# Altium schematic sheet IO.SchDoc: IO
size A4; ApprovedBy: Rachid AKKOUCHE; CheckedBy: Rachid AKKOUCHE; Author: Rachid AKKOUCHE; DrawnBy: Rachid AKKOUCHE; Engineer: Rachid AKKOUCHE; DocumentNumber: BRA20210209_2; SheetNumber: 2; SheetTotal: 4; Dessinepar: Rachid AKKOUCHE; ProjectName: Projet BRA
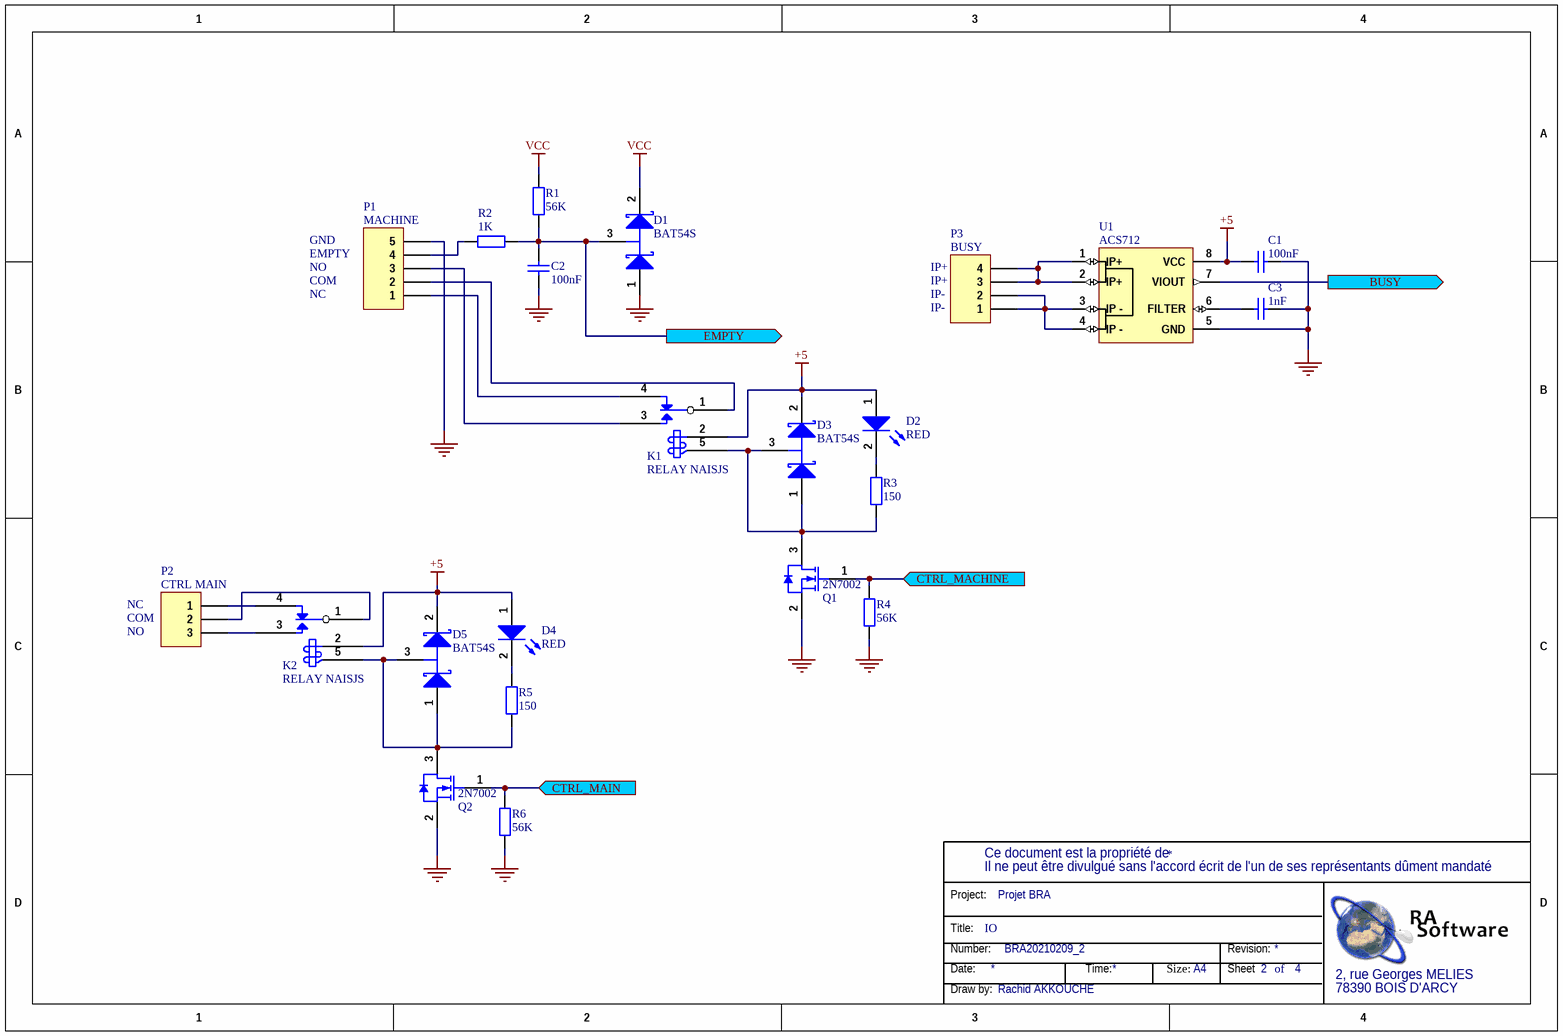
[diagram p0: IO.SchDoc]

## Parts
C1  100nF  [C 0805(2012)x0.65]
C2  100nF  [C 0805(2012)x0.65]
C3  1nF  [C 0805(2012)x0.65]
D1  BAT54S  [SOT23]
D2  RED  [0603-LEDR]
D3  BAT54S  [SOT23]
D4  RED  [0603-LEDR]
D5  BAT54S  [SOT23]
K1  RELAY NAISJS  [RELAIG5L]
K2  RELAY NAISJS  [RELAIG5L]
P1  MACHINE  [CO5P508-RIGHT]
P2  CTRL MAIN  [CO3P508 - 2]
P3  BUSY  [CO4P508]
Q1  2N7002  [SOT23]
Q2  2N7002  [SOT23]
R1  56K  [R 0805(2012)]
R2  1K  [R 0805(2012)]
R3  150  [R 0805(2012)]
R4  56K  [R 0805(2012)]
R5  150  [R 0805(2012)]
R6  56K  [R 0805(2012)]
U1  ACS712  [SOIC8]

## Ports
BUSY (out), CTRL_MACHINE (in), CTRL_MAIN (in), EMPTY (out)

## Nets
+5: C1.2 D2.1(A) D3.2(K) D4.1(A) D5.2(K) K1.2(COIL1) K2.2(COIL1) U1.8(VCC)
GND: C1.1 C2.1 C3.2 D1.1(A) P1.5 Q1.2(S) Q2.2(S) R4.1 R6.1 U1.5(GND)
VCC: D1.2(K) R1.2
BUSY: U1.7(VIOUT) ; port BUSY
CTRL_MACHINE: Q1.1(G) R4.2 ; port CTRL_MACHINE
CTRL_MAIN: Q2.1(G) R6.2 ; port CTRL_MAIN
EMPTY: C2.2 D1.3(C) R1.1 R2.1 ; port EMPTY
NetC3_1: C3.1 U1.6(FILTER)
NetD2_2: D2.2(K) R3.2
NetD3_1: D3.1(A) D3.3(C) K1.5(COIL2) Q1.3(D) R3.1
NetD4_2: D4.2(K) R5.2
NetD5_1: D5.1(A) D5.3(C) K2.5(COIL2) Q2.3(D) R5.1
NetK1_1: K1.1(COMMON) P1.2
NetK1_3: K1.3(NO) P1.3
NetK1_4: K1.4(NC) P1.1
NetK2_1: K2.1(COMMON) P2.2
NetK2_3: K2.3(NO) P2.3
NetK2_4: K2.4(NC) P2.1
NetP1_4: P1.4 R2.2
NetP3_1: P3.1 P3.2 U1.3(IP_-) U1.4(IP_-)
NetP3_3: P3.3 P3.4 U1.1(IP+) U1.2(IP+)

## Notes on the sheet
- GND
- NO
- NC
- COM
- EMPTY
- (near P3) IP+
- (near P3) IP-
- Project:
- Il ne peut être divulgué sans l'accord écrit de l'un de ses représentants dûment mandaté
- Ce document est la propriété de
- Title:
- Number:
- Date:
- Time:
- Size:
- A4
- Revision:
- Sheet
- of
- 2, rue Georges MELIES
- Draw by:
- 78390 BOIS D'ARCY

## Library data of the parts
C1 C2 = Cap 0805 100nF: Capacitor; Manufacturer: MULTICOMP; Manufacturer Part Number: MCCA000296; Supplier 1: Farnell; Supplier Part Number 1: 1759167; Pricing 1: 100=0,01, 500=0,008, 1000=0,006, 4000=0,005 (EUR); ComponentLink1URL: http://www.farnell.com/datasheets/1520827.pdf; ComponentLink1Description: http://www.farnell.com/datasheets/1520827.pdf
C3 = Cap 0805 1nF: Capacitor; Manufacturer: SAMSUNG; Manufacturer Part Number: CL05B102KB5NNNC; Unit: pcs; SuppliedAmount: 10000; MinAmount: 300; Multiples: 100; Type de condensateur: céramique; Tye de condensateur: MLCC; Tension de travail: 50V; Diélectrique: X7R; Tolérance: ±10%; Montage: SMD; Boîtier: 0402; Température de travail: -55...125°C; Supplier 1: TME; Category: Condensateurs MLCC SMD 0402; Stock 1: 25000; Pricing 1: 300=0,00208, 1000=0,00124, 10000=0,00069, 40000=0,00066, 100000=0,00064 (EUR); Weight: 0,012; Price Type: NET; Capacité: 1nF; Fabricant: SAMSUNG; ComponentLink1URL: http://www.tme.eu/fr/details/cl05b102kb5nnnc/condensateurs-mlcc-smd-0402/samsung/; ComponentLink1Description: http://www.tme.eu/fr/details/cl05b102kb5nnnc/condensateurs-mlcc-smd-0402/samsung/; Supplier Part Number 1: CL05B102KB5NNNC
D1 D3 D5 = BAT54S: Schottky Barrier Double Diode; Manufacturer: MULTICOMP; Courant, If moy.: 200; Tension, Vrrm: 30; Tension, Vf max..: 400; Temps trr max.: 5; Courant, Ifs max.: 600; Type de boîtier diode: SOT-23; Nombre de broches: 3; SVHC: No SVHC (19-Dec-2012); Configuration diode: Dual Series; Température, Tj max..: 150; Type de terminaison: SMD; Température d'utilisation min: -55; Courant, If, Vf: 10; Courant, Ir, max..: 2; Marquage, CMS: L44; Température de fonctionnement: -55°C à +150; Supplier 1: Farnell; Supplier Part Number 1: 1621835; Manufacturer Part Number: BAT54S; RoHS: YES; Stock 1: 52055; Pricing 1: 10=0,102, 250=0,074, 1000=0,06, 3000=0,053 (EUR); Diode Type: Schottky; Type de boîtier: SOT-23; courant Ifsm: 600; ComponentLink1URL: http://www.farnell.com/datasheets/1317753.pdf; ComponentLink1Description: http://www.farnell.com/datasheets/1317753.pdf; Température de fonctionnement max..: 150
D2 D4 = HSMH-C190: Surface Mount Chip LED, Red; Manufacturer: AVAGO TECHNOLOGIES; Manufacturer Part Number: HSMH-C190.; Taille de lampe: 0.8mm x 1; Couleur de LED: Rouge; Intensité lumineuse: 17; Angle, vision: 170°; Courant, direct, If: 20; Tension, direct à  If: 1.8; Montage LED: CMS; Forme de lentille: Rectangulaire; Longueur d'onde typ.: 626; SVHC: No SVHC (19-Dec-2012); Dissipation de puissance: 65; Intensité lumineuse min. à  If: 2.8; Intensité lumineuse typique: 10; Largeur (externe): 0.8; Longueur d'onde dominante: 639; Longueur d'onde, crête: 630; Longueur/hauteur: 1.6; Matière: AlGaAs; Nombre de broches: 2; Orientation de montage opto: Dessus; Orientation sortie de lumière: Top Emitting; Température de fonctionnement: -30°C à +85; Température de fonctionnement max..: 85; Température, stockage min.: -40; Température d'utilisation min: -30; Tension, Vf max..: 2.6; Tension, Vf min.: 2.1; Type de LED: Standard; Supplier 1: Farnell; Supplier Part Number 1: 8554641; RoHS: YES; Pricing 1: 5=0,06, 25=0,059, 100=0,057, 250=0,052, 500=0,047 (EUR); MSL: MSL 2A - 4 semaines; Couleur, LED: Rouge; Profondeur: 0.8; Température, stockage max..: 85; Tension, Vf typ.: 1.8; ComponentLink1URL: http://www.farnell.com/datasheets/313031.pdf; ComponentLink1Description: http://www.farnell.com/datasheets/313031.pdf; ComponentLink2URL: http://www.farnell.com/datasheets/55927.pdf; ComponentLink2Description: http://www.farnell.com/datasheets/55927.pdf; Couleur: RED
K1 K2 = RELAY NAISJS: Manufacturer: OMRON ELECTRONIC COMPONENTS; Manufacturer Part Number: G5LA1A412DC; Type de relais: Puissance; Tension, bobine c.c. nom.: 12; Courant de contact max..: 10; Tension AC nominale du contact: 250; Tension DC nominale du contact: 24; Résistance, bobine: 400; Configuration des contacts: SPST-NO; Type de bobine: CC; Courant de bobine: 30; Puissance de fonctionnement nominale: 360; Montage relais: Traversant; Largeur (externe): 15.8; Profondeur: 19.8; SVHC: No SVHC (20-Jun-2013); Supplier 1: Farnell; Supplier Part Number 1: 2213790; RoHS: YES; Pricing 1: 1=0,84, 10=0,74, 50=0,66, 100=0,59, 250=0,54 (EUR); Hauteur, dimension externe: 15.8; ComponentLink1URL: http://www.farnell.com/datasheets/1648381.pdf; ComponentLink1Description: http://www.farnell.com/datasheets/1648381.pdf
P1 = Header 5: Header, 5-Pin; LatestRevisionDate: 17-Jul-2002; LatestRevisionNote: Re-released for DXP Platform.; Publisher: Altium Limited
P2 = Header 3: Header, 3-Pin; LatestRevisionDate: 17-Jul-2002; LatestRevisionNote: Re-released for DXP Platform.; Publisher: Altium Limited
P3 = Header 4: Header, 4-Pin; LatestRevisionDate: 17-Jul-2002; LatestRevisionNote: Re-released for DXP Platform.; Publisher: Altium Limited
Q1 Q2 = 2N7002: N-channel Enhancement Mode Field-effect Transistor; Manufacturer: FAIRCHILD SEMICONDUCTOR; Supplier 1: Farnell; Supplier Part Number 1: 9845313; Manufacturer Part Number: 2N7002; RoHS: YES; Pricing 1: 5=0,138, 25=0,13, 100=0,059, 1000=0,049, 3000=0,026, 6000=0,0234 (EUR); ComponentLink1URL: http://www.farnell.com/datasheets/660093.pdf; ComponentLink1Description: http://www.farnell.com/datasheets/660093.pdf; ComponentLink2URL: http://www.farnell.com/datasheets/410597.pdf; ComponentLink2Description: http://www.farnell.com/datasheets/410597.pdf
R1 = Resistor 0805 56K: Resistor SMD 0805 56K; Manufacturer: MULTICOMP; Manufacturer Part Number: MC0.1W08051%56KFR; Product Range: MULTICOMP - MC Series; Résistance: 56; Puissance: 100; Tolérance de résistance: ± 1%; Type de boîtier de résistance: 0805; Type de résistance: Couche épaisse; Coefficient de température: ± 100; Tension: 150; Type de packaging: Full Reel; Resistor Mounting: CMS; Resistor Terminals: (Non Disponible); Supplier 1: Farnell; RoHS: YES; Pricing 1: 5000=0,001 (EUR); MSL: (Non Applicable); ComponentLink1URL: http://www.farnell.com/datasheets/1716700.pdf; ComponentLink1Description: http://www.farnell.com/datasheets/1716700.pdf; Supplier Part Number 1: 2129258
R2 = Resistor 0805 1K: Resistor SMD 0805 1K; Manufacturer: MULTICOMP; Manufacturer Part Number: MC0.1W08051%1KFR; Product Range: MULTICOMP - MC Series; Résistance: 1; Puissance: 100; Tolérance de résistance: ± 1%; Type de boîtier de résistance: 0805; Type de résistance: Couche épaisse; Coefficient de température: ± 100; Tension: 150; Type de packaging: Full Reel; Resistor Mounting: CMS; Supplier 1: Farnell; RoHS: YES; Pricing 1: 5000=0,001 (EUR); MSL: MSL 1 - Illimité; ComponentLink1URL: http://www.farnell.com/datasheets/1716700.pdf; ComponentLink1Description: http://www.farnell.com/datasheets/1716700.pdf; Supplier Part Number 1: 2129113
R3 R5 = Resistor 0805 150: Resistor SMD 0805 150; Manufacturer: YAGEO; Manufacturer Part Number: RC0805JR-07150KL; Unit: pcs; SuppliedAmount: 0; MinAmount: 100; Resistance: 150kΩ; Power: 0.125W; Tolerance: ±5%; Max. operating voltage: 150V; Max. overload voltage: 300V; Supplier 1: TME; Category: 0805 SMD Resistors; Stock 1: 6800; Pricing 1: 100=0.00566, 1000=0.0034, 5000=0.00111, 15000=0.00102, 50000=0.00088 (EUR); Weight: 0.028; Multiples: 100; Resistor type: thick film; Mounting: SMD; Case: 0805; Operating temperature: -55...155°C; Price Type: NET; ComponentLink1URL: http://static.tme.eu/products_pics/6/6/c/66cc5cd64257edd80ca8e9fd2040972d/56038.jpg; ComponentLink1Description: http://static.tme.eu/products_pics/6/6/c/66cc5cd64257edd80ca8e9fd2040972d/56038.jpg; Supplier Part Number 1: RC0805JR-07150K
R4 R6 = Resistor 0805 56K: Resistor; Manufacturer: MULTICOMP; Manufacturer Part Number: MC0.1W08051%56KFR; Product Range: MULTICOMP - MC Series; Résistance: 56; Puissance: 100; Tolérance de résistance: ± 1%; Type de boîtier de résistance: 0805; Type de résistance: Couche épaisse; Coefficient de température: ± 100; Tension: 150; Type de packaging: Full Reel; Resistor Mounting: CMS; Resistor Terminals: (Non Disponible); Supplier 1: Farnell; RoHS: YES; Pricing 1: 5000=0,001 (EUR); MSL: (Non Applicable); ComponentLink1URL: http://www.farnell.com/datasheets/1716700.pdf; ComponentLink1Description: http://www.farnell.com/datasheets/1716700.pdf; Supplier Part Number 1: 2129258
U1 = ACS712: HALL EFFECT CURRENT SENSOR; Manufacturer: ALLEGRO MICROSYSTEMS; Manufacturer Part Number: ACS712ELCTR-20A-T; Unit: pcs; SuppliedAmount: 10; MinAmount: 1; Type de capteur: Hall effet; Tension d'alimentation: 8V DC; Courant d'entrée: ± 20A; Température de travail: -40...85°C; Supplier 1: TME; Category: Capteurs de Hall; Stock 1: 844; Pricing 1: 1=3,39, 3=3,16, 10=2,92 (EUR); Weight: 0,336; Multiples: 1; Price Type: NET; Fabricant: ALLEGRO MICROSYSTEMS; ComponentLink1URL: http://www.tme.eu/fr/details/acs712elctr20at/capteurs-de-hall/allegro-microsystems/acs712elctr-20a-t/; ComponentLink1Description: http://www.tme.eu/fr/details/acs712elctr20at/capteurs-de-hall/allegro-microsystems/acs712elctr-20a-t/; Supplier Part Number 1: ACS712ELCTR20AT